# EAGLE design joystick (EAGLE 9.0.1)
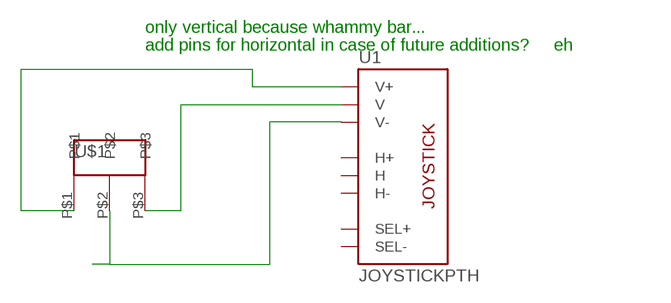
[diagram p0: schematic, sheet 1]

## Parts
U1  JOYSTICKPTH  [JOYSTICK]
U$1  3-PIN-HEADER  [3-PIN-HEADER]

## Nets
N$1: U1.V1(V+) U$1.P$1
N$2: U1.V2(V) U$1.P$3
N$3: U1.V3(V-) U$1.P$2
Unconnected: U1.B1A(SEL+) U1.B2A(SEL-) U1.H1(H+) U1.H2(H) U1.H3(H-)

## Notes on the sheet
- only vertical because whammy bar...
- add pins for horizontal in case of future additions? | eh

## Library data of the parts
U1 = adafruit:JOYSTICK: Thumb Joystick Joystick commonly found in PS2 controllers. Two pots and a select switch. Adapted from Sparkfun Library (but for more common 6mm switch sticks)
U$1 = mask_lbr:3-PIN-HEADER

## Net classes
0 default: width 0.61 mm, drill 0.254 mm, clearance 0.254 mm

## Board
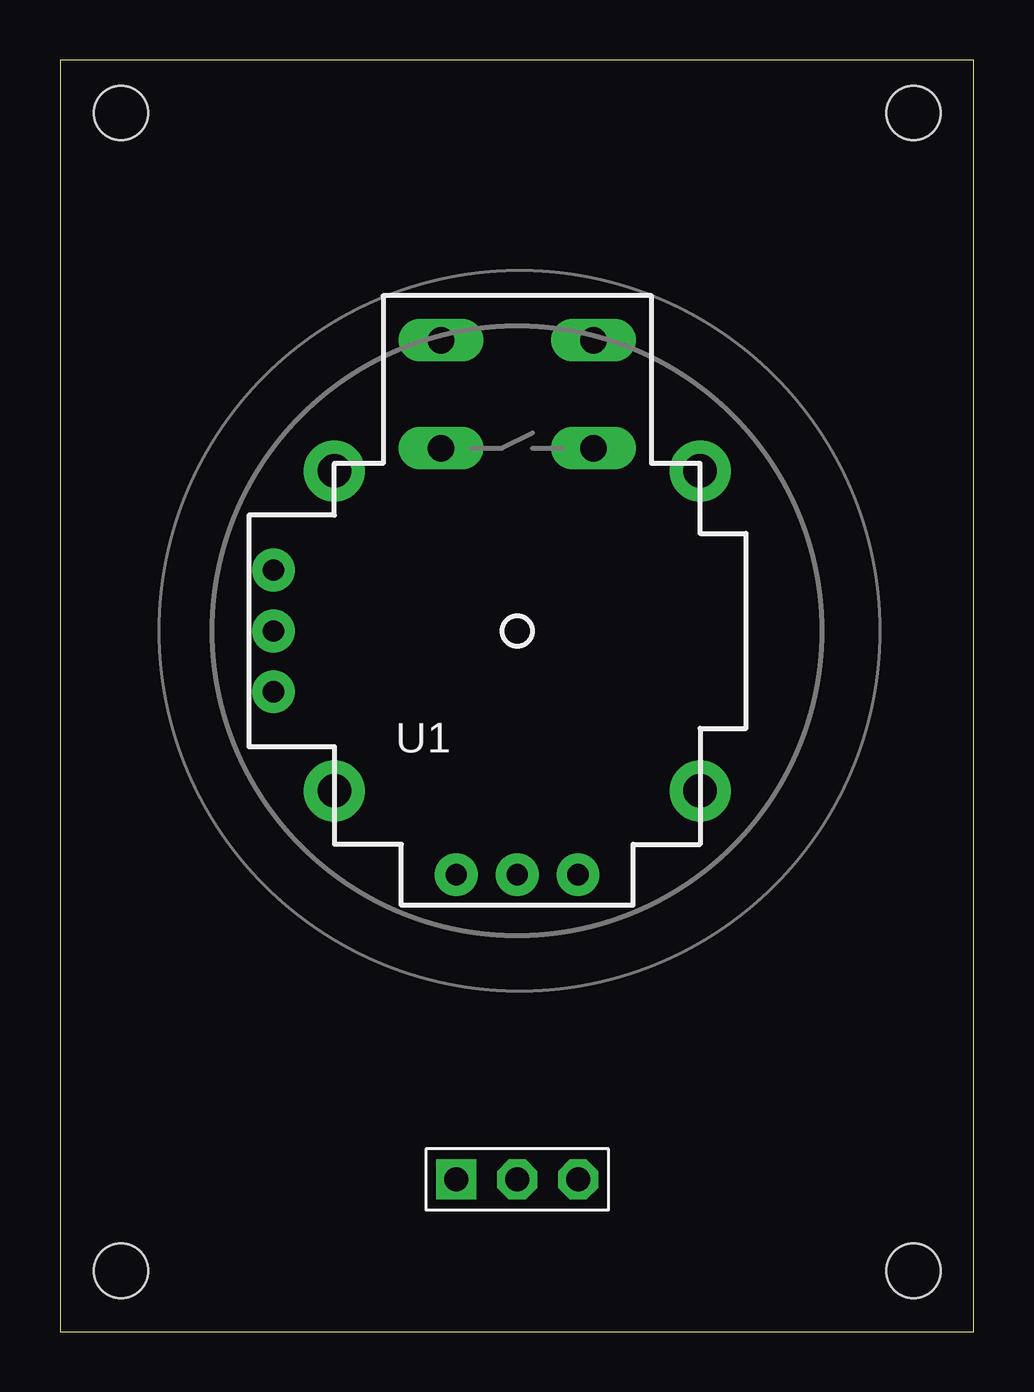
[diagram p1: board, top side]
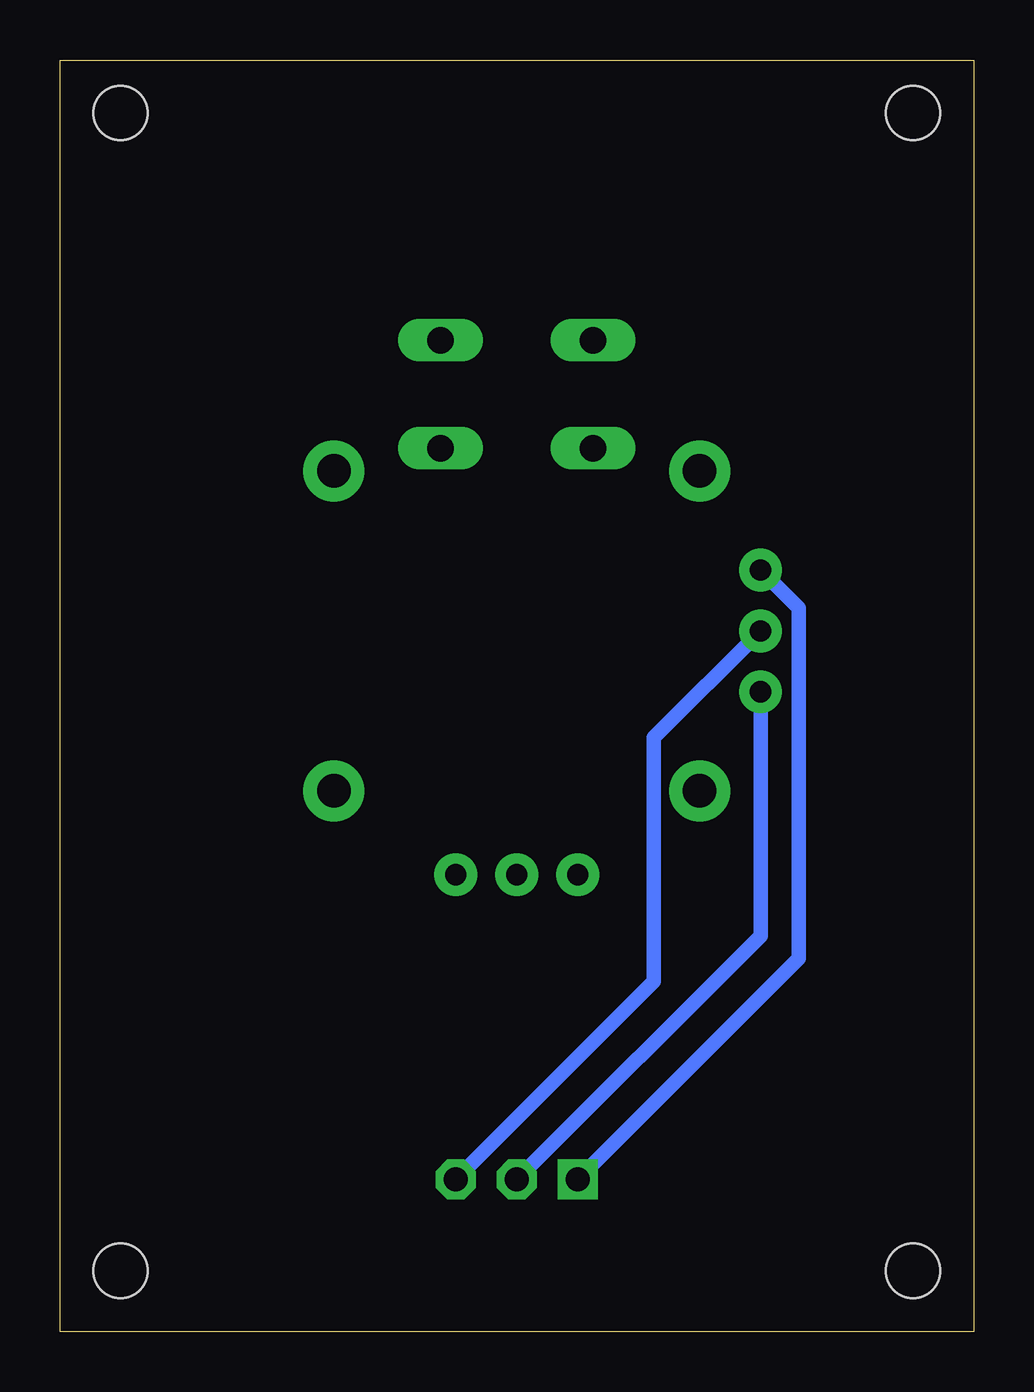
[diagram p2: board, bottom side, seen from below]

Size 38.08 x 53.01 mm. Coordinates in mm from the lower left corner, seen from the top.
Outline: 0,0 38.08,0 38.08,53.01 0,53.01 0,0
Copper layers (1*16): Top 0.035mm / dielectric 1.5mm / Bottom 0.035mm
Design rules "default": minimum track width 6mil, minimum drill 0.35mm, track to track 6mil, track to pad 6mil, pad to pad 6mil, via to via 6mil, smd to smd 6mil, copper to edge 40mil, drill to drill 6mil, minimum pad ring 10mil, minimum via ring 8mil, stop-mask expansion 4mil, vias tented up to drill 0mil, thermal gap 10mil
Holes 2.26 mm at 2.54,50.8 35.56,50.8 35.56,2.54 2.54,2.54

### Footprints (pad centres in the part's own frame; a part is rotated, then mirrored left to right if it is on the bottom)
JOYSTICK = drill 1.1 pad 1.778 long: B1A -3.175,12.12; B1B 3.175,12.12; B2A -3.175,7.62; B2B 3.175,7.62 | drill 0.889 pad 1.778: H1 -2.54,-10.16; H2 0,-10.16; H3 2.54,-10.16; V1 -10.16,2.54; V2 -10.16,0; V3 -10.16,-2.54 | drill 1.397 pad 2.54: MOUNT1 -7.62,6.668; MOUNT2 -7.62,-6.668; MOUNT3 7.62,-6.668; MOUNT4 7.62,6.668
3-PIN-HEADER = drill 1 pad 1.676 square: P$1 -2.54,0 | drill 1 pad 1.676 octagon: P$2 0,0; P$3 2.54,0

### Placement (x,y rotation side)
U1  19.05,29.21 0 top
U$1  19.05,6.35 0 top

### Tracks (layer width: path | path; a pad name or v marks a point on that pad's centre or on a via)
N$1
  Bottom 0.61: U$1.P$1 7.3,15.56 7.3,30.16 U1.V1
N$2
  Bottom 0.61: U$1.P$3 13.34,14.61 13.34,24.77 U1.V2
N$3
  Bottom 0.61: U$1.P$2 8.89,16.51 U1.V3